# EAGLE design pwrfet (EAGLE 4.13)

## Sheet 1 of 2
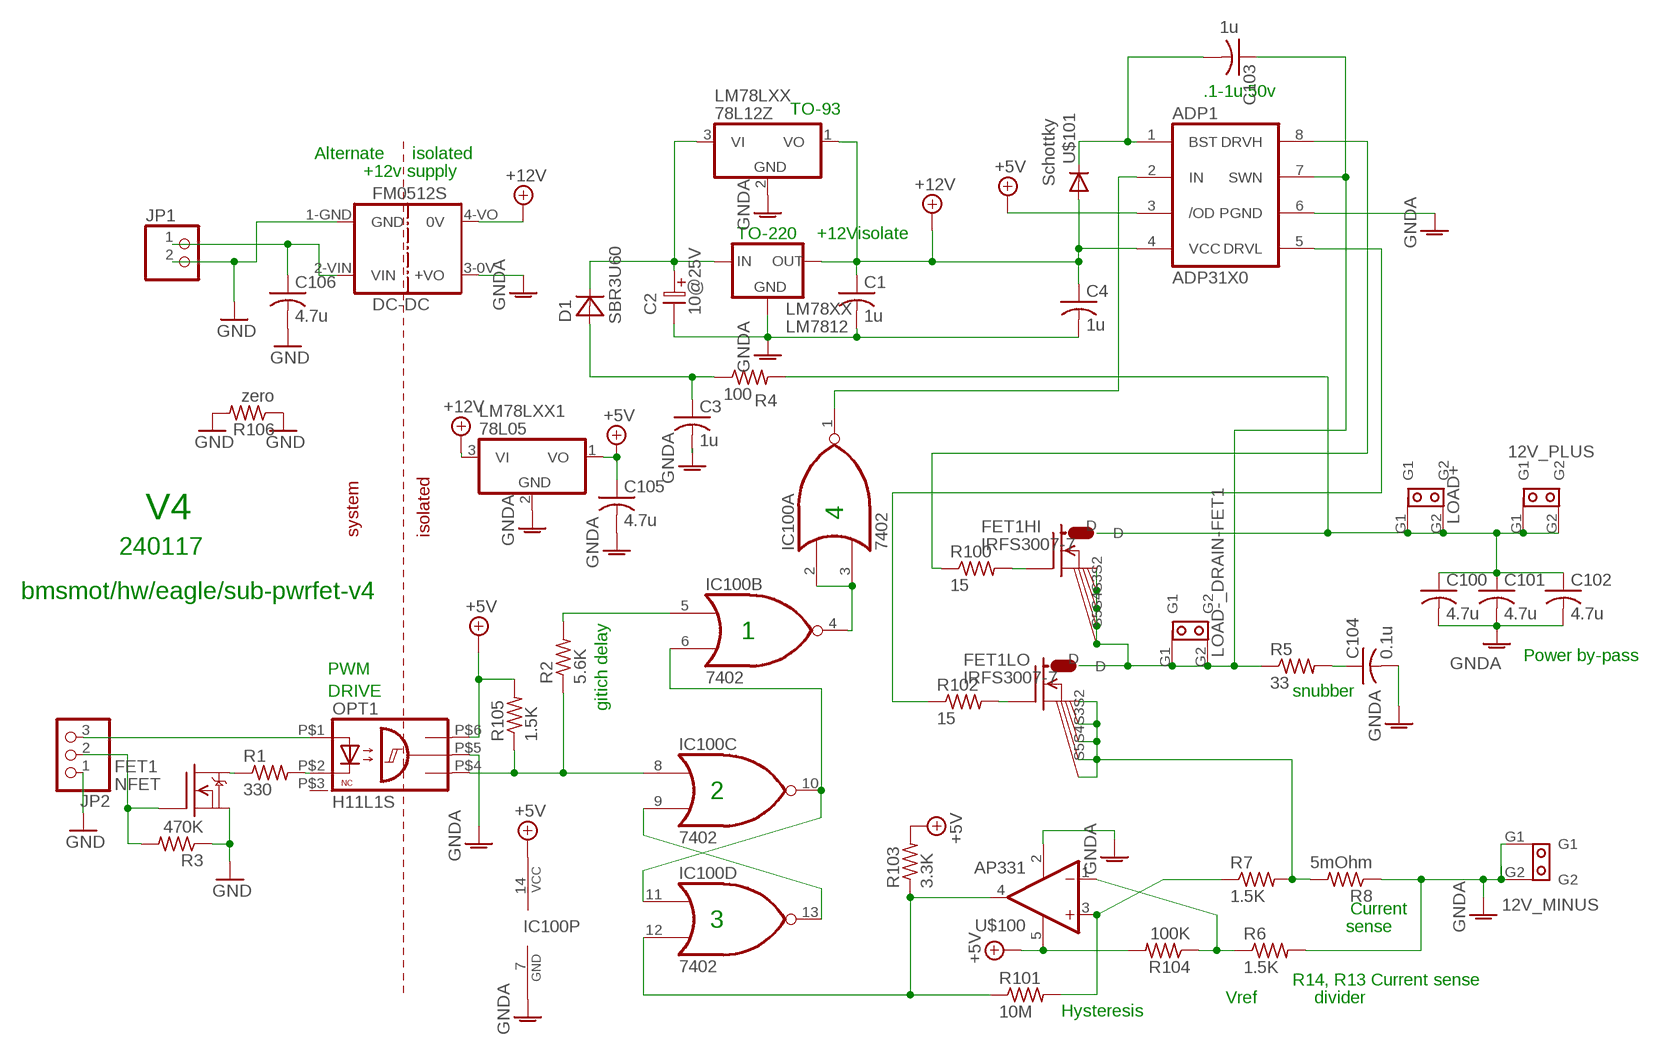
[diagram p0: schematic, sheet 1]

### Parts
12V_MINUS  SPADE-TAB  [SPADE_TAB]
12V_PLUS  SPADE-TAB  [SPADE_TAB]
ADP1  ADP31X0  [SO08]
C1  1u  C-USC0603  [C0603]
C2  10@25V  ELC-2,5L  [ES-2,5L]
C3  1u  C-USC0603  [C0603]
C4  1u  C-USC0603  [C0603]
C100  4.7u  C-USC0805  [C0805]
C101  4.7u  C-USC0805  [C0805]
C102  4.7u  C-USC0805  [C0805]
C103  1u  C-USC0805  [C0805]
C104  0.1u  C-USC0603  [C0603]
C105  4.7u  C-USC0805  [C0805]
C106  4.7u  C-USC0805  [C0805]
D1  SBR3U60  [POWERDI123]
FET1  NFET  DMN3404L  [SOT-23]
FET1HI  IRFS3007-7  [D2PAK-7]
FET1LO  IRFS3007-7  [D2PAK-7]
FM0512S  DC-DC  [DC-DC]
IC100  7402  [TSSOP14]
JP1  PINHD-1X2  [1X02]
JP2  PINHD-1X3  [1X03]
LM78LXX  78L12Z  [TO92]
LM78LXX1  78L05  78L12Z  [TO92]
LM78XX  LM7812  78XXS  [78XXS]
LOAD+  SPADE-TAB  [SPADE_TAB]
LOAD-_DRAIN-FET1  SPADE-TAB  [SPADE_TAB]
OPT1  H11L1S  H!!LX  [SMD-6]
R1  330  R-US_R0603  [R0603]
R2  5.6K  R-US_R0603  [R0603]
R3  470K  R-US_R0603  [R0603]
R4  100  R-US_R0603  [R0603]
R5  33  R-US_R0603  [R0603]
R6  1.5K  R-US_R0603  [R0603]
R7  1.5K  R-US_R0603  [R0603]
R8  5mOhm  R-US_R0805  [R0805]
R100  15  R-US_R0603  [R0603]
R101  10M  R-US_R0603  [R0603]
R102  15  R-US_R0603  [R0603]
R103  3.3K  R-US_R0603  [R0603]
R104  100K  R-US_R0603  [R0603]
R105  1.5K  R-US_R0603  [R0603]
R106  zero  R-US_R0603  [R0603]
U$100  AP331  [SOT-25]
U$101  Schottky  PMEG10020PMEG10020-123W  [SOD123W]

### Nets
+5V: ADP1.3(/OD) C105.1 IC100.14(P:VCC) LM78LXX1.1(VO) OPT1.P$6(VCC) R103.2 R104.2 R105.2 U$100.5(V+)
+5VAUX: C106.1 FM0512S.2-VIN(VIN) JP1.1
+12V: ADP1.4(VCC) C1.1 C4.1 FM0512S.4-VO(0V) LM78LXX1.3(VI) LM78LXX.1(VO) LM78XX.OUT U$101.C(A)
+PWR: 12V_PLUS.G1 12V_PLUS.G2 C100.1 C101.1 C102.1 FET1HI.D LOAD+.G1 LOAD+.G2 R4.2
+PWR_RC: C2.1 D1.C LM78LXX.3(VI) LM78XX.IN
BST: ADP1.1(BST) C103.2 U$101.A(C)
COMP_OUT: IC100.12(D:I1) R101.1 R103.1 U$100.4(OUT)
DRAINFET1: ADP1.7(SWN) C103.1 FET1HI.S2(S1) FET1HI.S3(S2) FET1HI.S5(S3) FET1HI.S6(S4) FET1HI.S7(S5) FET1LO.D LOAD-_DRAIN-FET1.G1 LOAD-_DRAIN-FET1.G2 R5.1
FET-LO-SRC: FET1LO.S2(S1) FET1LO.S3(S2) FET1LO.S5(S3) FET1LO.S6(S4) FET1LO.S7(S5) R7.2 R8.2
GATE-FET1: FET1LO.G R102.2
GND: C106.2 FET1.2(S) FM0512S.1-GND(GND) JP1.2 JP2.1 R3.1 R106.1 R106.2
GNDA: 12V_MINUS.G1 12V_MINUS.G2 ADP1.6(PGND) C1.2 C2.2 C3.2 C4.2 C100.2 C101.2 C102.2 C104.2 C105.2 FM0512S.3-0V(+VO) IC100.7(P:GND) LM78LXX1.2(GND) LM78LXX.2(GND) LM78XX.GND OPT1.P$5(GND) R6.2 R8.1 U$100.2(V-)
HO: ADP1.8(DRVH) R100.1
IN+: R6.1 R104.1 U$100.1(-IN)
IN-: R7.1 R101.2 U$100.3(+IN)
ISO-ANODE: JP2.3 OPT1.P$1(A)
ISO-IN-DRAIN-FET1: FET1.3(D) R1.1
ISOPWM: IC100.8(C:I0) OPT1.P$4(OUT) R2.1 R105.1
LO: ADP1.5(DRVL) R102.1
N$1: FET1HI.G R100.2
N$2: OPT1.P$2(C) R1.2
N$3: C3.1 D1.A R4.1
NOR1-IN1: IC100.6(B:I1) IC100.10(C:O) IC100.11(D:I0)
NOR1-OUT: IC100.2(A:I0) IC100.3(A:I1) IC100.4(B:O)
NOR2-IN2_NOR3-OUT: IC100.9(C:I1) IC100.13(D:O)
NOROUT_DRIVER_IN: ADP1.2(IN) IC100.1(A:O)
NOT1-DELAY-IN: IC100.5(B:I0) R2.2
ONOFF-FET1: FET1.1(G) JP2.2 R3.2
SNUB-RC: C104.1 R5.2
Unconnected: OPT1.P$3(NC)

### Notes on the sheet
- .1-1u 50v
- TO-93
- Alternate | isolated
- +12v supply
- TO-220 | +12Visolate
- V4 | 4
- system | isolated
- 240117
- bmsmot/hw/eagle/sub-pwrfet-v4
- 1
- Power by-pass
- PWM
- DRIVE | snubber
- gitich delay
- 2
- Current
- 3 | sense
- R14, R13 Current sense
- Vref | divider
- Hysteresis

## Sheet 2 of 2

## Library data of the parts
12V_MINUS 12V_PLUS LOAD+ LOAD-_DRAIN-FET1 = DEH:SPADE-TAB
ADP1 = 74xx-us:ADP31X0
C1 C3 C4 C100-C106 = rcl:C-US: CAPACITOR, American symbol
C2 = DEH:ELC-2,5L
D1 = diode-1:SBR3U60
FET1 = transistor-fet:DMN3404L
FET1HI FET1LO = transistor-fet:IRFS3007-7
FM0512S = DEH:DC-DC
IC100 = 74xx-us:74*02: Quad 2-input NOR gate
JP1 = pinhead:PINHD-1X2: PIN HEADER
JP2 = pinhead:PINHD-1X3: PIN HEADER
LM78LXX LM78LXX1 = linear:78*: Positive VOLTAGE REGULATOR
LM78XX = v-reg:78XXS: VOLTAGE REGULATOR
OPT1 = optocoupler:H!!LX
R1-R8 R100-R106 = rcl:R-US_: RESISTOR, American symbol
U$100 = linear:AP331
U$101 = diode-1:PMEG10020

## Board
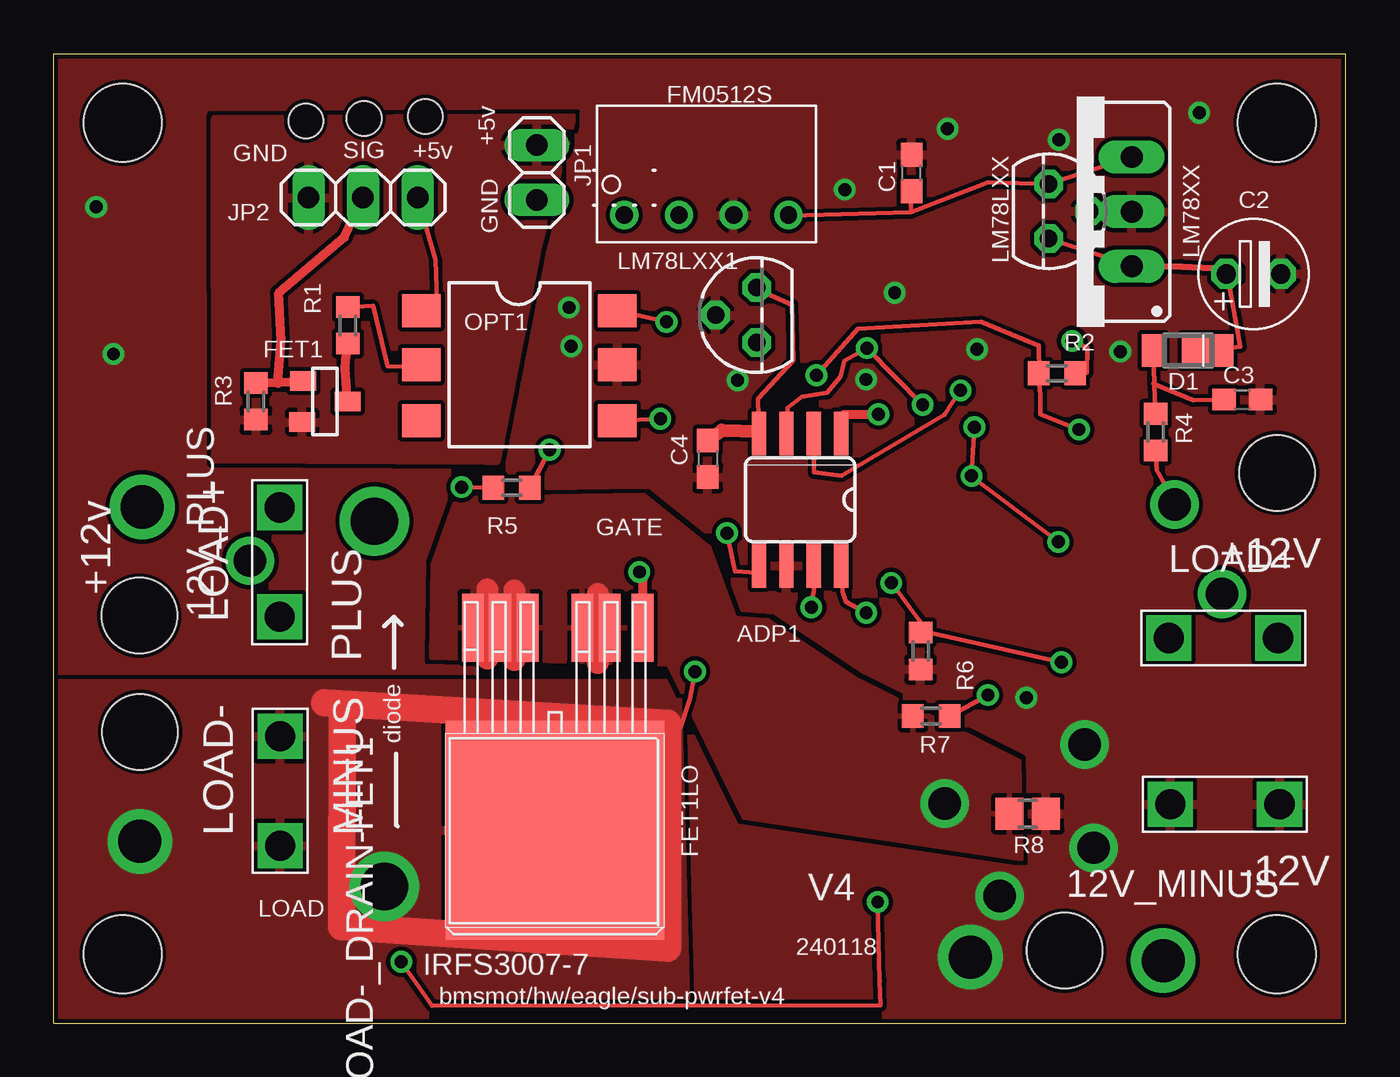
[diagram p1: board, top side]
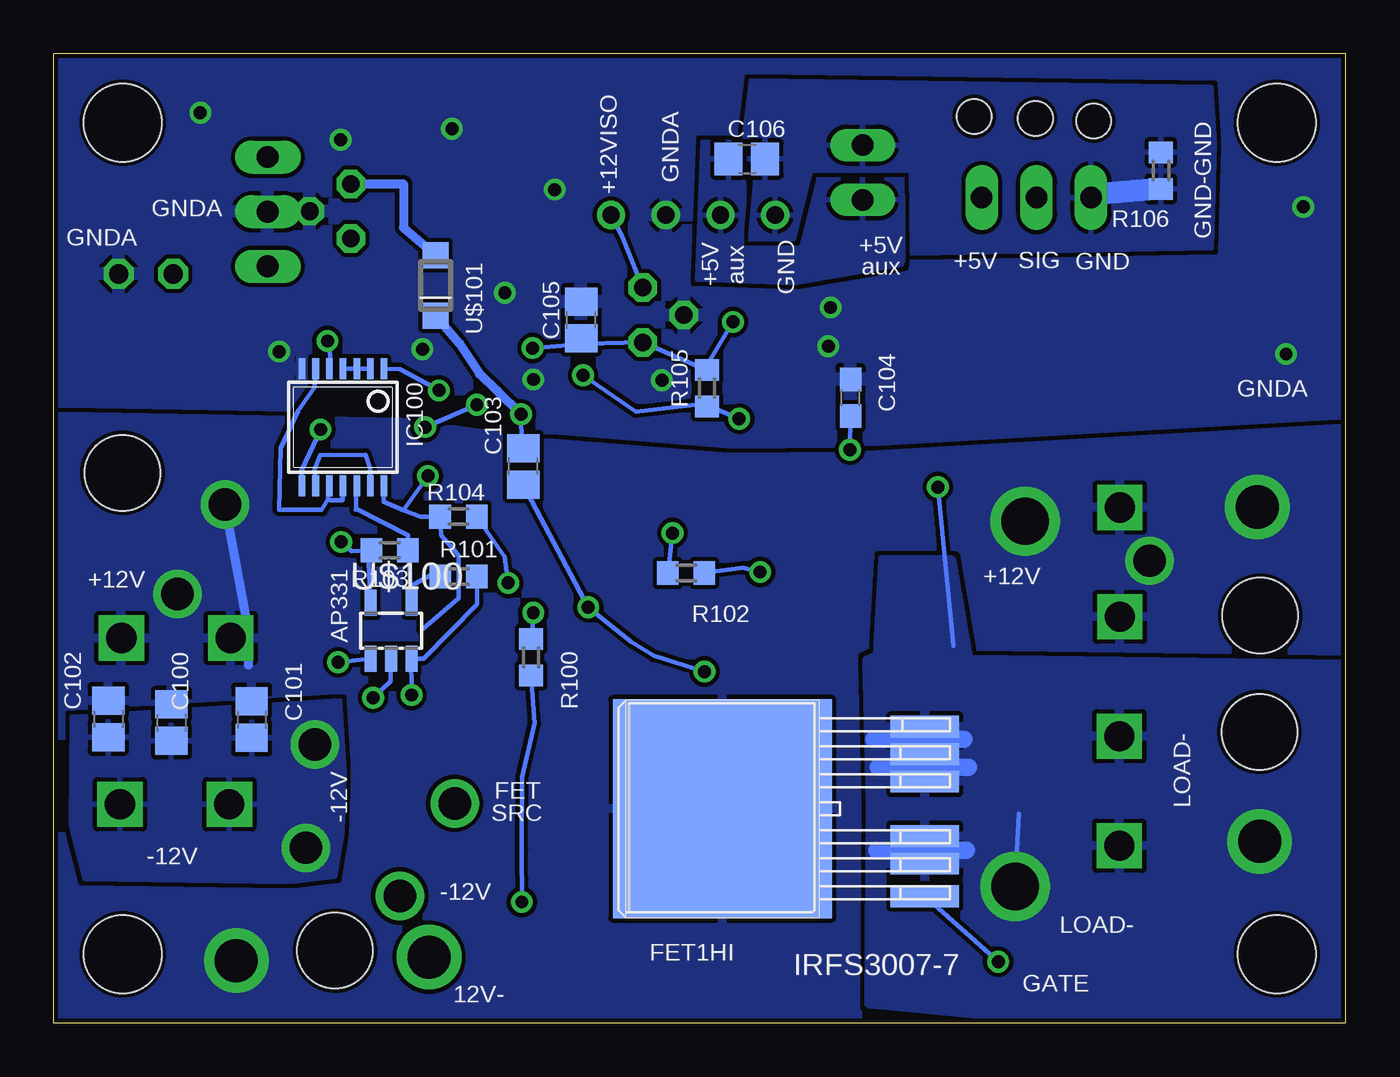
[diagram p2: board, bottom side, seen from below]

Size 60 x 45 mm. Coordinates in mm from the lower left corner, seen from the top.
Outline: 0,0 0,45 60,45 60,0 0,0
Copper layers (1*16): Top 0.035mm / dielectric 1.5mm / Bottom 0.035mm
Design rules "default": minimum track width 0.2mm, minimum drill 0.6mm, track to track 0.2mm, track to pad 0.2mm, pad to pad 0.2mm, via to via 8mil, smd to smd 0.2mm, copper to edge 8mil, drill to drill 8mil, minimum pad ring 10mil, minimum via ring 8mil, stop-mask expansion 4mil, vias tented up to drill 0mil, thermal gap 8mil
Holes 3.6 mm at 3.2,3.2 56.8,3.2 3.2,41.8 56.8,41.8
Holes 3.5 mm at 56.81,25.54 3.97,18.92 4.01,13.53 46.94,3.37
Holes 1.6 mm at 11.7,41.88 14.41,42 17.26,42.09

### Footprints (pad centres in the part's own frame; a part is rotated, then mirrored left to right if it is on the bottom)
SPADE_TAB = drill 1.4 square: G1 -2.54,0; G2 2.54,0
SO08 = smd 0.66 x 2.032: 1 -1.905,-3.073; 2 -0.635,-3.073; 3 0.635,-3.073; 4 1.905,-3.073; 5 1.905,3.073; 6 0.635,3.073; 7 -0.635,3.073; 8 -1.905,3.073
C0603 = smd 1.1 x 1: 1 -0.85,0; 2 0.85,0
ES-2,5L = drill 0.889 pad 1.27 octagon: 1 0,0; 2 2.54,0
C0805 = smd 1.3 x 1.5: 1 -0.85,0; 2 0.85,0
POWERDI123 = smd 1.1 x 1.5: A 1,0 | smd 2.4 x 1.5: C -1.5,0
SOT-23 = smd 0.9 x 1.2: 1 -1,-1.006; 2 0.9,-1.056; 3 -0.05,1.056
D2PAK-7 = smd 10.16 x 10.16: D 0,4.572 | smd 1.016 x 3.175: G -4.064,-4.826; S2 -2.54,-4.826; S3 -1.27,-4.826; S5 1.27,-4.826; S6 2.54,-4.826; S7 3.81,-4.826
DC-DC = drill 0.8 round: 1-GND 0,-1.27; 2-VIN 2.54,-1.27; 3-0V 5.08,-1.27; 4-VO 7.62,-1.27
TSSOP14 = smd 0.305 x 0.991: 1 -1.905,-2.718; 2 -1.27,-2.718; 3 -0.635,-2.718; 4 0,-2.718; 5 0.635,-2.718; 6 1.27,-2.718; 7 1.905,-2.718; 8 1.905,2.718; 9 1.27,2.718; 10 0.635,2.718; 11 0,2.718; 12 -0.635,2.718; 13 -1.27,2.718; 14 -1.905,2.718
1X02 = drill 1 long: 1 -1.27,0; 2 1.27,0
1X03 = drill 1 long: 1 -2.54,0; 2 0,0; 3 2.54,0
TO92 = drill 0.813 octagon: 1 -1.27,0; 2 0,1.905; 3 1.27,0
78XXS = drill 1.016 long: GND 0,-2.54; IN -2.54,-2.54; OUT 2.54,-2.54
SMD-6 = smd 1.52 x 1.78: P$1 -2.5,-4.5; P$2 0,-4.5; P$3 2.6,-4.5; P$4 2.6,4.6; P$5 0,4.6; P$6 -2.5,4.6
R0603 = smd 1 x 1.1: 1 -0.85,0; 2 0.85,0
R0805 = smd 1.3 x 1.5: 1 -0.85,0; 2 0.85,0
SOT-25 = smd 0.55 x 1.2: 1 -0.95,-1.3; 2 0,-1.3; 3 0.95,-1.3; 4 0.95,1.3; 5 -0.95,1.3
SOD123W = smd 1.2 x 1.2: A 1.4,0; C -1.4,0

### Placement (x,y rotation side)
12V_MINUS  54.39,10.16 180 top
12V_PLUS  10.49,21.4 90 top
ADP1  34.66,24.3 180 top
C1  39.84,39.47 90 top
C2  54.45,34.78 0 top
C3  55.2,28.94 0 top
C4  30.37,26.2 270 top
C100  54.54,13.95 270 bottom
C101  50.81,14.09 270 bottom
C102  57.47,14.12 270 bottom
C103  38.2,25.85 90 bottom
C104  23,29.04 90 bottom
C105  35.51,32.64 90 bottom
C106  27.81,40.12 0 bottom
D1  52.08,31.23 180 top
FET1  12.59,28.8 270 top
FET1HI  24.38,9.95 90 bottom
FET1LO  23.27,13.53 180 top
FM0512S  26.5,38.78 0 top
IC100  46.57,27.66 180 bottom
JP1  22.44,39.49 90 top
JP2  14.36,38.32 0 top
LM78LXX  46.21,37.69 270 top
LM78LXX1  32.64,32.87 90 top
LM78XX  47.52,37.67 90 top
LOAD+  54.32,17.88 0 top
LOAD-_DRAIN-FET1  10.52,10.78 270 top
OPT1  21.57,30.57 270 top
R1  13.66,32.4 90 top
R2  46.59,30.17 0 top
R3  9.39,28.86 90 top
R4  51.17,27.44 270 top
R5  21.27,24.86 0 top
R6  40.26,17.27 270 top
R7  40.75,14.26 180 top
R8  45.23,9.72 180 top
R100  37.84,16.99 270 bottom
R101  41.2,20.74 0 bottom
R102  30.64,20.9 0 bottom
R103  44.4,21.95 180 bottom
R104  41.21,23.51 180 bottom
R105  29.67,29.48 90 bottom
R106  8.58,39.58 90 bottom
U$100  44.34,18.21 0 bottom
U$101  42.27,34.24 270 bottom

### Tracks (layer width: path | path; a pad name or v marks a point on that pad's centre or on a via)
+5V  (via drill 0.6)
  Top 0.2: v37.76,31.34 v40.35,28.71 | v42.76,27.67 v42.62,25.4
  Top 0.203: v28.45,32.55 OPT1.P$6 | v42.62,25.4 42.63,25.37 v46.66,22.34 | ADP1.3 34.07,28.57 34.74,29.08 35.91,29.26 36.53,30.01 36.72,30.76 v37.76,31.34
  Bottom 0.2: R103.2 45.38,21.38 45.34,20.35 45.24,19.48 U$100.5 45.49,19.06 | 43.74,23.82 42.95,23.51 R104.2 42.02,22.66 41.21,21.73 41.2,19.71 42.88,18.3 | 43.74,23.82 44.69,24.19 44.69,24.88 IC100.14 | 35.3,31.54 v37.76,31.34 | v40.35,28.71 v42.76,27.67 | 43.74,23.82 43.73,23.87 v42.62,25.4
  Bottom 0.203: R105.2 29.79,30.37 | 29.79,30.37 v28.45,32.55 | 29.79,30.37 32.7,31.62 LM78LXX1.1 35.3,31.54 C105.1 | R103.2 46.16,21.9 v46.66,22.34
+5VAUX
  pour Bottom (rank 3): 30.12,34.5 29.87,40.93 28,40.92 27.85,36.33 26.58,36.01 25.48,36.2 24.59,39.67 20.05,39.58 20.02,37.78 20.6,35.2 25.62,34.35
+12V
  Top 0.2: LM78LXX1.3 32.49,34.15 34.27,33.36 34.36,30.76 32.72,28.98 ADP1.4 32.74,27.48
  Top 0.202: LM78XX.OUT LM78LXX.1
  Top 0.203: 39.81,37.63 C1.1 | FM0512S.4-VO 34.14,37.49 39.81,37.63 | 39.81,37.63 43.41,39.03 46.28,38.94 LM78LXX.1
  Top 0.61: C4.1 31.02,27.53 32.74,27.48
  Bottom 0.203: LM78LXX1.3 32.66,34.17 33.59,36.48 34.09,37.51 FM0512S.4-VO
  Bottom 0.406: U$101.C 43.76,36.94 43.76,38.96 LM78LXX.1
+PWR  (via drill 1.5, 2, 2.2)
  Top 0.203: R4.2 51.23,25.68 52.15,24.02 v52.05,24.07
  Bottom 0.406: v52.05,24.07 50.96,18.21 50.96,16.63
  other vias: 51.52,2.9 4.11,23.96 54.26,19.93 14.89,23.3 9.11,21.47
  pour Bottom (rank 3): -1.34,-1.99 -1.4,27.71 23,26.31 28.7,26.27 37.38,26.98 43.82,27.89 62.1,28.21 62.14,-2.04
+PWR_RC
  Top 0.202: LM78XX.IN 50.15,35.14 LM78LXX.3
  Top 0.203: D1.C 55.11,31.41 54.54,34.63 C2.1
  Top 0.305: LM78XX.IN 52.38,35.12 53.81,35.04 C2.1
BST  (via drill 0.6)
  Top 0.406: ADP1.1 36.7,28.26 v38.3,28.27
  Bottom 0.203: v38.3,28.27 38.31,27.72 C103.2
  Bottom 0.406: U$101.A 41.15,31.55 40.23,30.14 39.41,29.36 v38.3,28.27
COMP_OUT
  Bottom 0.2: 43.44,20.16 43.48,21.17 R103.1 43.55,22.64 45.96,23.87 | U$100.4 43.44,19.59 43.44,20.16 | R101.1 42.54,20.77 43.47,20.27 43.44,20.16 | IC100.12 45.97,24.93 45.96,23.87 | 45.96,23.87 45.98,23.82
DRAINFET1  (via drill 0.6, 2, 2.2)
  Top 0.202: v29.78,16.32 29.54,15.06 29.1,13.7 28.5,13.88 | v18.93,24.89 R5.1
  Top 0.203: v35.18,19.3 35.32,19.39 35.09,19.26 35.32,20.05 ADP1.7
  Top 1.016: 28.5,9.43 28.27,9.43
  Top 1.27: 12.58,14.87 28.5,13.91 28.5,13.88 28.5,9.43 28.51,3.48 13.37,4.48 13.39,14.78
  Bottom 0.202: v29.78,16.32 32.12,17.05
  Bottom 0.203: v15.35,6.34 15.18,9.71 | C103.1 v35.18,19.3 33.18,17.71 32.12,17.05 | 18.22,17.52 v18.93,24.89
  Bottom 0.813: 17.61,8.03 21.77,8.03 | 17.53,11.88 21.69,11.88 | 17.74,13.18 21.9,13.18
  other vias: 4,8.43
  pour Top (rank 2): 28.95,15.79 29.38,-0.7 -1.18,-0.74 -1.7,15.79 4.24,15.79
  pour Bottom (rank 2): 22.09,10.18 22.16,0.91 -3.55,-1.57 -3.31,4.74 -0.2,16.66 17.49,16.89 18.3,21.5 21.52,21.52 21.77,17.04 22.25,16.84
FET-LO-SRC  (via drill 1.5)
  Top 0.203: FET1LO.S6 20.77,18.35 20.14,16.93 21.33,16.9 21.39,16.87 | FET1LO.S2 25.79,18.25 25.26,19.93
  Top 1.016: 20.13,20.14 20.14,20.14 20.14,16.93 | 21.39,16.87 21.39,20.07 | 25.26,16.72 25.26,19.93
  other vias: 41.38,10.2
  pour Top: 17.58,21.29 18.72,24.4 27.41,24.53 30.42,22.12 31.64,18.82 33.19,18.69 37.41,15.89 44.86,12.16 44.93,7.62 32.06,9.54 28.56,16.63 17.53,16.96
GATE-FET1  (via drill 0.6)
  Top 0.203: 27.37,20.6 v27.2,20.94
  Top 0.406: FET1LO.G 27.37,20.6
  Bottom 0.202: v27.2,20.94 28,21.13 R102.2
GND
  Bottom 1.016: JP2.1 11.82,38.45 R106.1
  pour Top (rank 2): 24.06,42.06 22.46,36.12 20.54,26.12 20.1,26.12 7.51,26.18 7.5,41.97
  pour Bottom (rank 2): 20.17,39.59 24.86,39.6 25.64,36.41 27.64,36.39 27.34,39.77 28.09,39.79 27.59,43.75 6.27,43.46 6.1,40.82 6.24,35.99 20.11,35.74
GNDA  (via drill 0.6, 1.5, 2)
  Bottom 0.203: U$100.2 44.36,15.88 v45.17,15.11
  other vias: 43.93,5.9 42.57,3.06 47.87,12.94 39.05,33.91 42.88,31.29 2.77,31.07 23.92,33.22 24.03,31.43 36.73,38.7 46.68,41.01 53.19,42.26 41.51,41.52 49.53,31.18 1.97,37.89 31.76,29.84 37.72,29.88 48.29,8.14
  pour Top (rank 3): -1.4,45.87 19.64,46.07 62.39,45.83 62.24,-2 -1.37,-2.17 -1.44,16.74
  pour Bottom (rank 5): -3.66,27.45 21.11,23.51 44.45,24.62 63.48,24.97 63.19,45.02 -3.57,45.51
  pour Bottom (rank 2): 59.16,14.22 46.7,15 46.49,11.63 46.59,8.9 46.92,6.78 49.04,6.55 58.56,6.68 59.22,9.21
HO  (via drill 0.6)
  Top 0.202: 36.79,19.57 36.64,20.04
  Top 0.203: v37.73,19.05 36.79,19.57 | ADP1.8 36.66,20.46 36.64,20.04
  Bottom 0.2: R100.1 37.82,17.78 v37.73,19.05
IN+  (via drill 0.6)
  Top 0.203: v46.79,16.75 40.28,18.2 R6.1 40.26,18.27 40.22,18.66 v38.9,20.43
  Bottom 0.2: 39.07,21.66 R104.1
  Bottom 0.203: U$100.1 45.34,16.91 v46.79,16.75 | v38.9,20.43 39.07,21.66
IN-  (via drill 0.6)
  Top 0.2: R7.1 v43.38,15.23
  Bottom 0.203: v43.38,15.23 43.39,15.99 43.42,16.86 U$100.3 43.43,16.91 42.84,16.91 40.34,19.45 R101.2
ISO-ANODE
  Top 0.203: 16.86,38.36 JP2.3 17.73,35.42 17.82,32.87 OPT1.P$1
ISO-IN-DRAIN-FET1
  Top 0.406: FET1.3 13.54,30.39 13.54,30.77 R1.1
ISOPWM  (via drill 0.6)
  Top 0.2: v35.42,30.08 37.35,32.23 43.05,32.55
  Top 0.203: OPT1.P$4 v28.17,28.06 | v47.61,27.56 45.82,28.27 45.83,29.14 R2.1 45.78,30.18 45.76,31.44 43.05,32.55
  Bottom 0.2: 29.83,28.75 32.97,28.39 v35.42,30.08
  Bottom 0.203: R105.1 29.83,28.75 v28.17,28.06 | IC100.8 48.49,24.94 48.49,25.66 v47.61,27.56
LO  (via drill 0.6)
  Top 0.203: ADP1.5 32.67,20.9 31.65,20.98 v31.27,22.75
  Bottom 0.202: v31.27,22.75 R102.1
N$1  (via drill 0.6)
  Top 0.202: v16.14,2.85 17.58,0.8 38.39,0.82
  Top 0.203: v38.26,5.62 38.26,5.6 38.36,1.97 | 38.39,0.82 38.36,1.97 | 38.36,1.97 38.37,1.97
  Bottom 0.2: 38.26,11.42 37.67,13.91 R100.2
  Bottom 0.202: v16.14,2.85 FET1HI.G
  Bottom 0.203: v38.26,5.62 38.27,8.06 38.26,11.42
N$2
  Top 0.203: R1.2 14.82,33.29 15.5,30.49 17.86,30.44 OPT1.P$2
N$3
  Top 0.203: D1.A 51.08,31.1 51.12,29.68 | R4.1 51.12,29.68 | C3.1 52.92,28.91 51.08,29.68 51.12,29.68
NOR1-IN1
  Bottom 0.2: IC100.11 46.58,24.27 47.2,24.28 47.26,24.29 IC100.10
  Bottom 0.203: 47.26,24.29 47.28,24.29 47.56,23.83 49.55,23.84 49.46,26.68 48.66,28.43 47.88,29.52 47.84,30.36 IC100.6
NOR1-OUT
  Bottom 0.203: IC100.3 | IC100.3 45.95,30.39 IC100.2 | 46.61,30.38 IC100.4 | IC100.3 46.61,30.38 | 46.61,30.38
NOR2-IN2_NOR3-OUT
  Bottom 0.2: IC100.9 47.88,25.72 47.63,26.36 45.52,26.39 45.31,25.76 45.33,24.9 IC100.13
NOROUT_DRIVER_IN  (via drill 0.6)
  Top 0.2: ADP1.2 35.31,25.57 36.59,25.41 41.36,28.24 v42.11,29.37
  Bottom 0.2: v42.11,29.37 43.91,30.37
  Bottom 0.203: IC100.1 44.69,30.38 43.91,30.37
NOT1-DELAY-IN  (via drill 0.6)
  Top 0.203: R2.2 47.98,30.2 48.01,31.35 v47.29,31.67
  Bottom 0.203: IC100.5 47.16,31.06 v47.29,31.67
ONOFF-FET1
  Top 0.406: FET1.1 11.63,29.8 10.4,29.76 | R3.2 10.4,29.76 | 10.4,29.76 10.41,29.7 10.56,31.68 10.45,33.91 13.49,36.48 14.28,38.2 JP2.2
SNUB-RC  (via drill 0.6)
  Top 0.202: R5.2 v23.02,26.61
  Bottom 0.202: v23.02,26.61 C104.1

### Text on the board
tPlace: GND | +5v | +5v | SIG | GND
bPlace: GNDA
tNames: +12v | GATE | +12V | LOAD+ | PLUS | diode | LOAD- | MINUS | LOAD | V4 | -12V | 240118 | IRFS3007-7 | bmsmot/hw/eagle/sub-pwrfet-v4
bNames: +12VISO | GND-GND | GNDA | +5V | GND | aux | +5V | GNDA | GND | SIG | +5V | aux | GNDA | +12V | +12V | AP331 | LOAD- | -12V | FET | SRC | -12V | -12V | LOAD- | IRFS3007-7 | GATE | 12V-